# EAGLE design I2C Line Sensor (EAGLE 6.2)
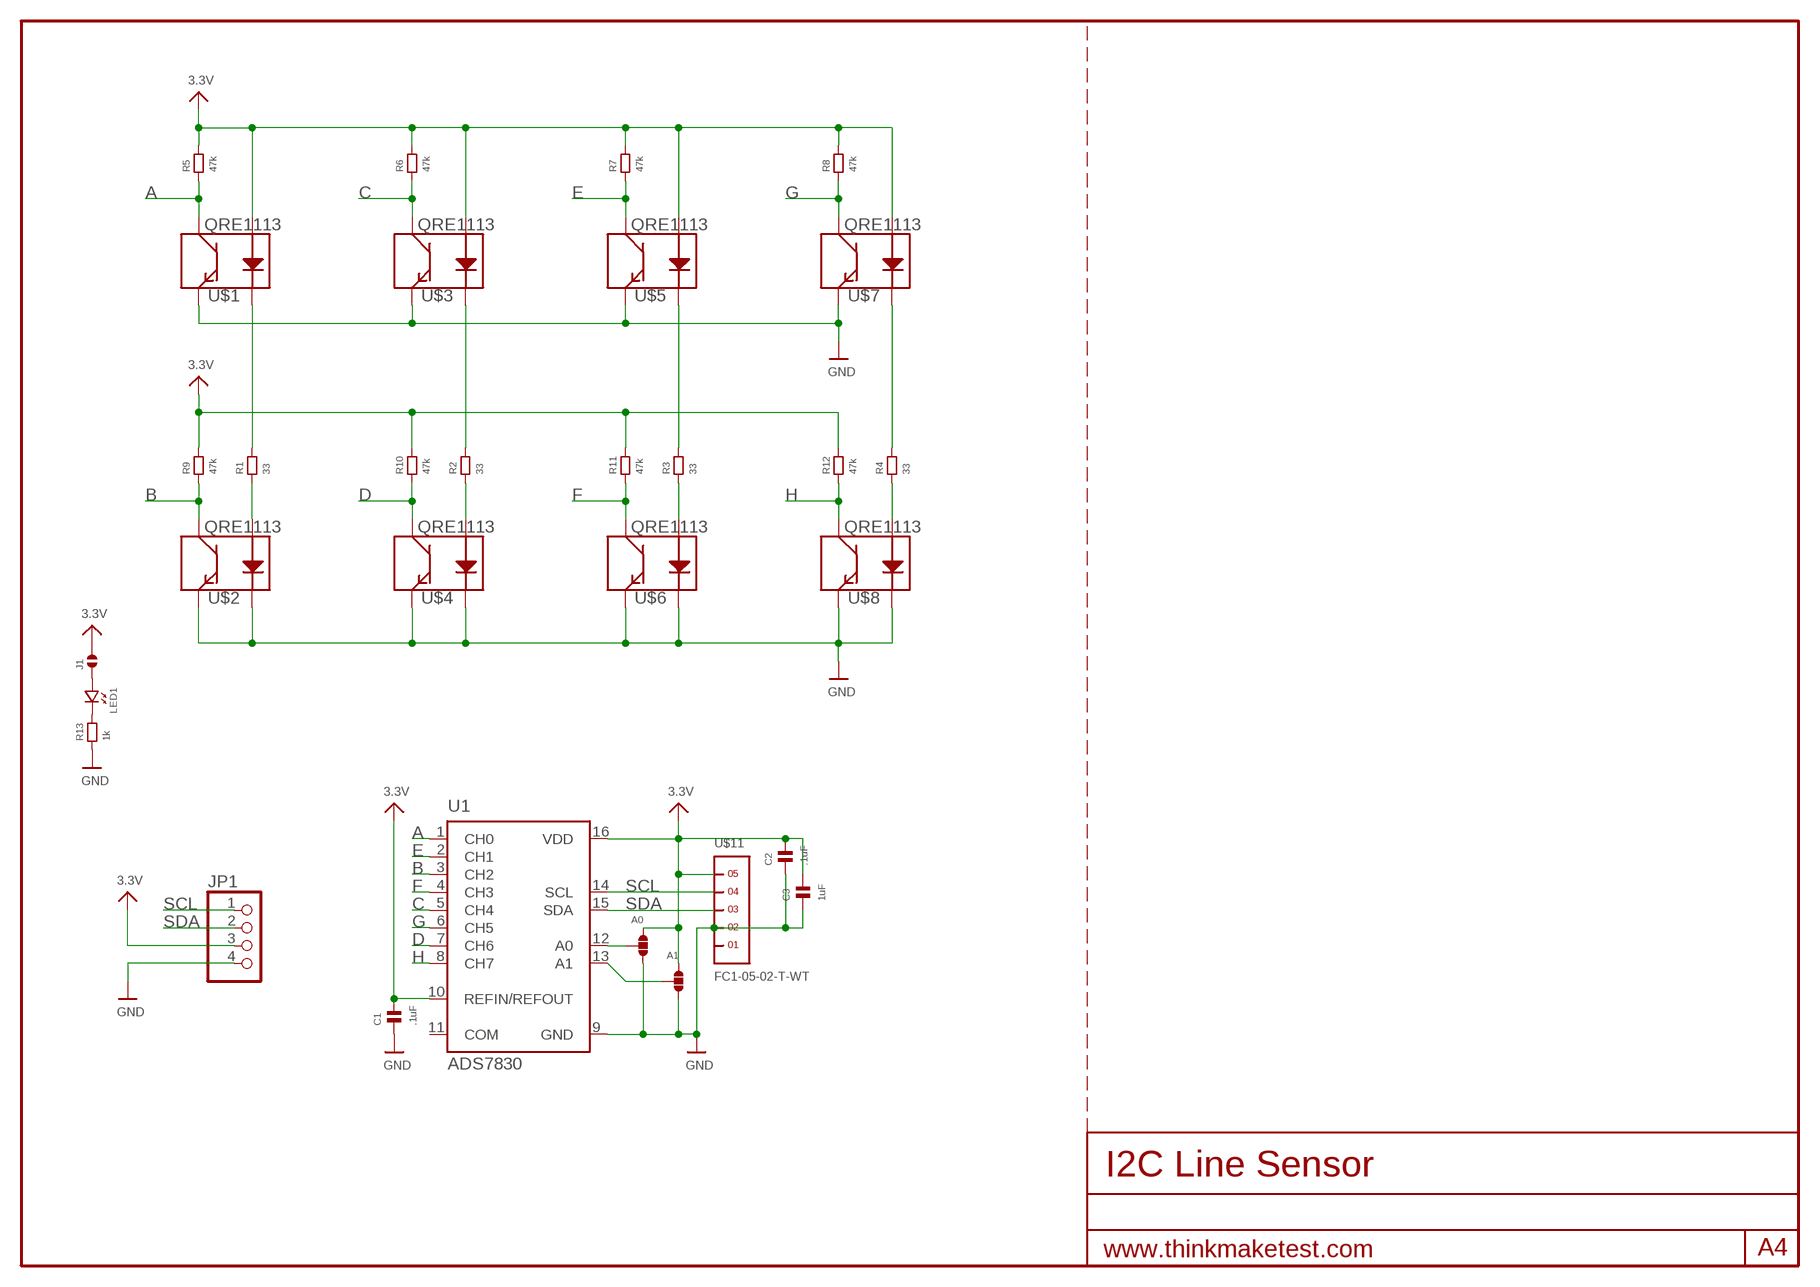
[diagram p0: schematic, sheet 1]

## Parts
A0  SOLDERJUMPER.3.LRG.23  [3.LRG.23]
A1  SOLDERJUMPER.3.LRG.23  [3.LRG.23]
C1  .1uF  CAPACITOR.0603  [0603]
C2  .1uF  CAPACITOR.0603  [0603]
C3  1uF  CAPACITOR.0603  [0603]
J1  SOLDERJUMPER.2.MED  [2.MED]
JP1  HEADER-1X4  [1X04_OVAL]
LED1  LED.0603  [0603.LED]
R1  33  RESISTOR.0603  [0603]
R2  33  RESISTOR.0603  [0603]
R3  33  RESISTOR.0603  [0603]
R4  33  RESISTOR.0603  [0603]
R5  47k  RESISTOR.0603  [0603]
R6  47k  RESISTOR.0603  [0603]
R7  47k  RESISTOR.0603  [0603]
R8  47k  RESISTOR.0603  [0603]
R9  47k  RESISTOR.0603  [0603]
R10  47k  RESISTOR.0603  [0603]
R11  47k  RESISTOR.0603  [0603]
R12  47k  RESISTOR.0603  [0603]
R13  1k  RESISTOR.0603  [0603]
U1  ADS7830  ADS7828  [TSSOP16-PW]
U$1  QRE1113  [QRE1113]
U$2  QRE1113  [QRE1113]
U$3  QRE1113  [QRE1113]
U$4  QRE1113  [QRE1113]
U$5  QRE1113  [QRE1113]
U$6  QRE1113  [QRE1113]
U$7  QRE1113  [QRE1113]
U$8  QRE1113  [QRE1113]
U$11  FC1-05-02-T-WT  [FC1-05-02-T-WT]

## Nets
3.3V: A0.1 A1.1 C1.2 C2.2 C3.2 J1.2 JP1.3 R5.2 R6.2 R7.2 R8.2 R9.2 R10.2 R11.2 R12.2 U1.10(REFIN/REFOUT) U1.16(VDD) U$1.1(A) U$3.1(A) U$5.1(A) U$7.1(A) U$11.5
A: R5.1 U1.1(CH0) U$1.3(C)
B: R9.1 U1.3(CH2) U$2.3(C)
C: R6.1 U1.5(CH4) U$3.3(C)
D: R10.1 U1.7(CH6) U$4.3(C)
E: R7.1 U1.2(CH1) U$5.3(C)
F: R11.1 U1.4(CH3) U$6.3(C)
G: R8.1 U1.6(CH5) U$7.3(C)
GND: A0.3 A1.3 C1.1 C2.1 C3.1 JP1.4 R13.1 U1.9(GND) U$1.4(E) U$2.2(K) U$2.4(E) U$3.4(E) U$4.2(K) U$4.4(E) U$5.4(E) U$6.2(K) U$6.4(E) U$7.4(E) U$8.2(K) U$8.4(E) U$11.2
H: R12.1 U1.8(CH7) U$8.3(C)
N$1: A0.2 U1.12(A0)
N$2: R1.2 U$1.2(K)
N$3: R1.1 U$2.1(A)
N$4: R2.1 U$4.1(A)
N$5: R2.2 U$3.2(K)
N$6: R3.2 U$5.2(K)
N$7: R3.1 U$6.1(A)
N$8: R4.2 U$7.2(K)
N$9: R4.1 U$8.1(A)
N$10: A1.2 U1.13(A1)
N$11: LED1.P$2 R13.2
N$12: J1.1 LED1.P$1
SCL: JP1.1 U1.14(SCL) U$11.4
SDA: JP1.2 U1.15(SDA) U$11.3
Unconnected: U1.11(COM) U$11.1

## Library data of the parts
A0 A1 = .solderjumper:SOLDERJUMPER.3
C1-C3 = .standardparts:CAPACITOR
J1 = .solderjumper:SOLDERJUMPER.2
JP1 = microbuilder:HEADER-1X4: PIN HEADER
LED1 = .standardparts:LED
R1-R13 = .standardparts:RESISTOR
U1 = burr-brown:ADS7828: 12-Bit, 8-Channel Sampling ANALOG-TO-DIGITAL CONVERTER with I2C? Interface Source: www.ti.com .. ADS7828.pdf
U$1-U$8 = SparkFun:QRE1113
U$11 = samtec:FC1-05-02-T-WT

## Board
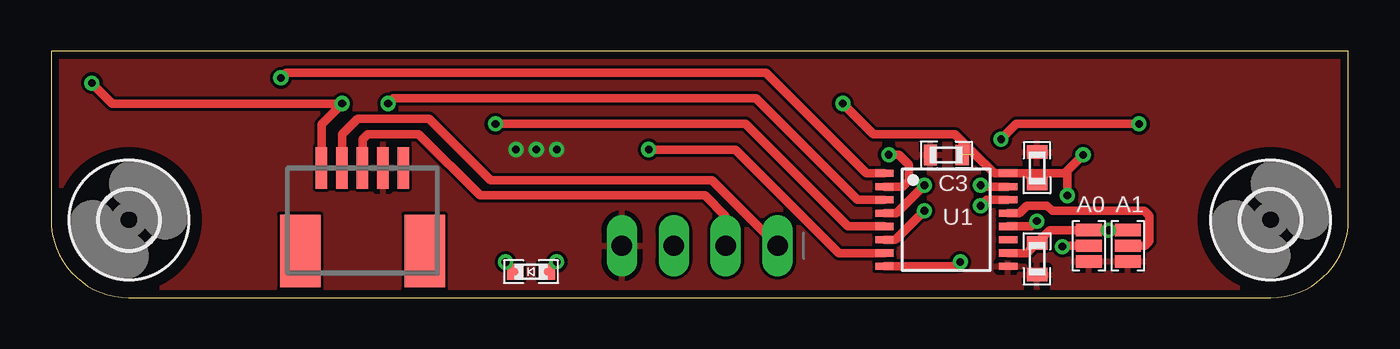
[diagram p1: board, top side]
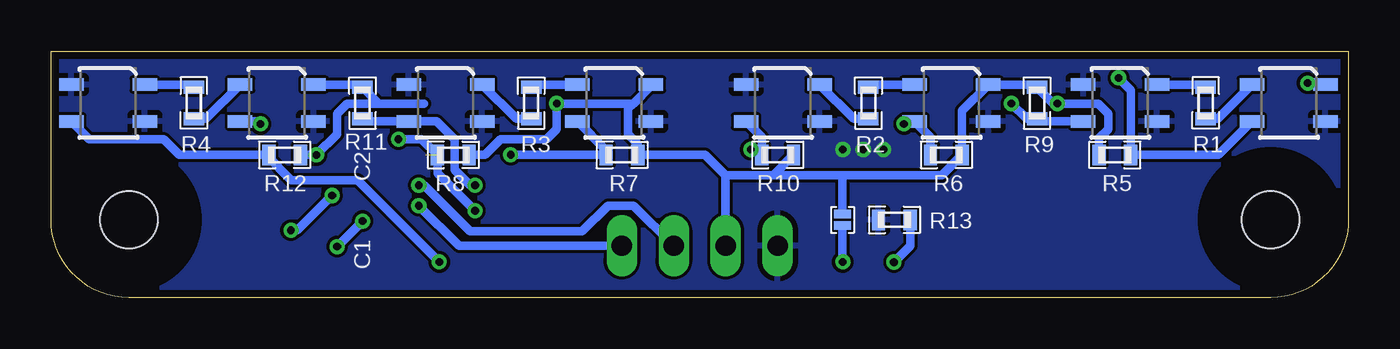
[diagram p2: board, bottom side, seen from below]

Size 63.5 x 12.06 mm. Coordinates in mm from the lower left corner, seen from the top.
Outline: 63.5,12.06 0,12.06 0,3.81 arc90 3.81,0 59.69,0 arc90 63.5,3.81 63.5,12.06
Copper layers (1*16): Top 0.0356mm / dielectric 1.5011mm / Bottom 0.0356mm
Design rules: minimum track width 6mil, minimum drill 13mil, track to track 6mil, track to pad 6mil, pad to pad 6mil, via to via 6mil, smd to smd 6mil, copper to edge 15mil, drill to drill 6mil, minimum pad ring 7mil, minimum via ring 7mil, stop-mask expansion 4mil, vias tented up to drill 0mil, thermal gap 10mil

### Footprints (pad centres in the part's own frame; a part is rotated, then mirrored left to right if it is on the bottom)
3.LRG.23 = smd 0.61 x 1.27: 1 -0.762,0; 2 0,0; 3 0.762,0
0603 = smd 0.65 x 1: 1 -0.775,0; 2 0.775,0
2.MED = smd 0.406 x 0.813: 1 -0.279,0; 2 0.279,0
1X04_OVAL = drill 1 long: 1 -3.81,0; 2 -1.27,0; 3 1.27,0; 4 3.81,0
0603.LED = smd 0.8 x 0.8: P$1 -0.775,0; P$2 0.775,0
TSSOP16-PW = smd 0.35 x 0.9: 1 -2.275,-3.025; 2 -1.625,-3.025; 3 -0.975,-3.025; 4 -0.325,-3.025; 5 0.325,-3.025; 6 0.975,-3.025; 7 1.625,-3.025; 8 2.275,-3.025; 9 2.275,3.025; 10 1.625,3.025; 11 0.975,3.025; 12 0.325,3.025; 13 -0.325,3.025; 14 -0.975,3.025; 15 -1.625,3.025; 16 -2.275,3.025
QRE1113 = smd 1.2 x 0.6: 1 -1.8,-0.9; 2 1.8,-0.9; 3 1.8,0.9; 4 -1.8,0.9
FC1-05-02-T-WT = smd 0.559 x 2.032: 1 -2,0; 2 -1,0; 3 0,0; 4 1,0; 5 2,0 | smd 1.98 x 3.56: P$1 -3.048,4.064; P$2 3.048,4.064
MOUNTINGHOLE_2.8 = hole 2.8: 0,0

### Placement (x,y rotation side)
A0  50.8,2.54 270 top
A1  52.7,2.54 270 top
C1  48.26,1.91 90 top
C2  48.26,6.35 270 top
C3  43.81,6.99 0 top
J1  24.77,3.81 90 bottom
JP1  31.75,2.54 180 top
LED1  23.5,1.27 180 top
R1  6.99,9.53 270 bottom
R2  23.5,9.53 90 bottom
R3  40.01,9.53 90 bottom
R4  56.52,9.53 270 bottom
R5  11.43,6.99 180 bottom
R6  19.68,6.99 0 bottom
R7  35.56,6.99 0 bottom
R8  43.81,6.99 0 bottom
R9  15.24,9.53 90 bottom
R10  27.94,6.99 0 bottom
R11  48.26,9.53 90 bottom
R12  52.07,6.99 0 bottom
R13  22.23,3.81 0 bottom
U1  43.81,3.81 270 top
U$1  2.92,9.53 180 bottom
U$2  11.18,9.53 180 bottom
U$3  19.43,9.53 180 bottom
U$4  27.69,9.53 180 bottom
U$5  35.94,9.53 180 bottom
U$6  44.2,9.53 180 bottom
U$7  52.45,9.53 180 bottom
U$8  60.71,9.53 180 bottom
U$11  15.24,6.35 180 top
U$12  [MOUNTINGHOLE_2.8]  3.81,3.81 0 top
U$13  [MOUNTINGHOLE_2.8]  59.69,3.81 0 top

### Tracks (layer width: path | path; a pad name or v marks a point on that pad's centre or on a via)
3.3V  (via drill 0.38)  (1 unrouted)
  Top 0.406: U1.10 47.77,2.19 C1.2 48.88,3.3 A0.1 v51.76,3.3 A1.1 | 47.75,6.08 U1.16 46.16,6.08 45.17,7.08 | v2,10.5 3,9.5 v14.25,9.5 13.24,8.49 U$11.5 | 45.17,7.08 44.25,8 40.25,8 v38.75,9.5 | 45.17,6.99 45.17,7.08 | C2.2 47.75,6.08 | 47.75,6.08 49.62,6.08 49.75,6.22 | v49.75,5 49.75,6.22 | 49.75,6.22 v50.52,6.99
  Bottom 0.406: U$7.1 48.38,10.43 R11.2 47.46,9.5 | R5.2 12.21,7.79 11.75,8.25 11.75,9 12.25,9.5 v14.25,9.5 14.44,9.5 R9.2 15.37,10.43 U$3.1 18.91,9.15 R6.2 19.89,6 24.77,6 | 47.46,9.5 45.25,9.5 | 47.46,9.5 49,9.5 49.5,9 49.5,8 v50.52,6.99 R12.2 | v51.76,3.3 51.45,3.3 v49.75,5 | U$1.1 1.2,10.5 v2,10.5 | 30.5,6 31.48,6.99 R7.2 34.78,7.54 35.25,8 35.25,9.25 35,9.5 | 30.5,6 28.15,6 | 28.15,6 R10.2 | JP1.3 30.48,5.98 30.5,6 | U$5.1 34.14,10.36 35,9.5 | 35,9.5 v38.75,9.5 38.75,8.25 39.25,7.75 41.5,7.75 42.27,6.99 R8.2 | 28.15,6 24.77,6 | J1.2 24.77,6
A  (via drill 0.38)
  Top 0.406: U1.1 39.91,6.08 35,11 11.5,11 v11.25,10.75
  Bottom 0.406: U$1.3 6.36,6.99 R5.1 10.65,10.15 v11.25,10.75
B  (via drill 0.38)
  Top 0.406: U1.3 39.47,4.79 34.5,9.75 16.75,9.75 v16.5,9.5
  Bottom 0.406: U$2.3 15.12,8.62 R9.1 15.75,8.75 v16.5,9.5
C  (via drill 0.38)
  Top 0.406: U1.5 39.02,3.48 34,8.5 v21.75,8.5
  Bottom 0.406: R6.1 20.46,7.85 U$3.3 21.62,8.62 v21.75,8.5
D  (via drill 0.38)
  Top 0.406: U1.7 38.56,2.19 33.5,7.25 v29.25,7.25
  Bottom 0.406: U$4.3 28.71,7.85 R10.1 28.98,7.25 v29.25,7.25
E  (via drill 0.38)
  Top 0.406: U1.2 41.69,5.43 42,5.75 42,6.5 41.5,7 v41,7
  Bottom 0.406: U$5.3 36.34,7.22 R7.1 v41,7
F  (via drill 0.38)
  Top 0.406: U1.4 41.38,4.13 v42.75,5.5
  Bottom 0.406: R11.1 48.13,8.62 U$6.3 44.62,8.62 43.75,7.75 43.75,6.25 43,5.5 v42.75,5.5
G  (via drill 0.38)
  Top 0.406: U1.6 41.34,2.83 v42.75,4.25 | v46.5,7.75 47.25,8.5 v53.25,8.5
  Bottom 0.406: v42.75,4.25 44.59,6.09 R8.1 45.35,7.75 v46.5,7.75 | U$7.3 53.38,8.62 v53.25,8.5
GND  (via drill 0.38)
  other vias: 22.75,7.25 23.75,7.25 24.75,7.25
  pour Top (rank 6): 0,12.06 63.5,12.06 63.5,2.54 arc-90 60.96,0 2.54,0 arc-90 0,2.54
  pour Bottom: 0,12.06 63.5,12.06 63.5,0 0,0
H  (via drill 0.38)
  Top 0.406: U1.8 44.28,1.53 v44.5,1.75
  Bottom 0.406: U$8.3 61.63,7.75 58,7.75 57.23,6.99 52.98,6.99 | 52.98,6.99 R12.1 | v44.5,1.75 48.5,5.75 51.75,5.75 52.98,6.99
N$1  (via drill 0.38)
  Top 0.406: A0.2 49.54,2.54 v49.5,2.5 | v48.25,3.75 47.98,3.48 U1.12
  Bottom 0.406: v48.25,3.75 v49.5,2.5
N$2
  Bottom 0.406: U$1.2 6.4,8.75 R1.2
N$3
  Bottom 0.406: R1.1 7.11,10.43 U$2.1
N$4
  Bottom 0.406: U$4.1 24.21,8.75 R2.1
N$5
  Bottom 0.406: R2.2 23.37,10.43 U$3.2
N$6
  Bottom 0.406: R3.2 39.88,10.43 U$5.2
N$7
  Bottom 0.406: U$6.1 40.72,8.75 R3.1
N$8
  Bottom 0.406: U$7.2 55.93,8.75 R4.2
N$9
  Bottom 0.406: R4.1 56.64,10.43 U$8.1
N$10
  Top 0.406: U1.13 47.38,4.13 47.75,4.5 48.75,4.5 49,4.25 53.5,4.25 53.75,4 53.75,2.75 53.54,2.54 A1.2
N$11  (via drill 0.38)
  Top 0.406: LED1.P$2 v22.25,1.74 v22.25,1.75
  Bottom 0.406: v22.25,1.74 21.45,2.54 R13.2
N$12  (via drill 0.38)
  Top 0.406: LED1.P$1 v24.75,1.75
  Bottom 0.406: v24.75,1.75 24.77,1.76 J1.1
SCL  (via drill 0.38)
  Top 0.406: v45.5,4.5 45.78,4.79 U1.14 | JP1.1 32.35,5.75 21.5,5.75 18.5,8.75 15,8.75 14.24,7.99 U$11.4
  Bottom 0.406: JP1.1 43.54,2.54 v45.5,4.5
SDA  (via drill 0.38)
  Top 0.406: v45.5,5.5 45.56,5.43 U1.15 | U$11.3 15.24,7.74 15.5,8 18,8 21,5 32,5 33.02,3.98 JP1.2
  Bottom 0.406: JP1.2 34.98,4.5 36.25,4.5 37.5,3.25 43,3.25 45.25,5.5 v45.5,5.5

### Text on the board
tDocu: + | 1 | + | 2 | + | 3 | + | 4 | 5 | + | 6 | + | 7 | + | 8 | + | GND | VCC | SDA | SCL | PWR
bDocu: PWR On